# EasyEDA Pro project TPS5430开关电源设计.eprj

# Schematic Schematic1
Create Date: 2023-10-11; Page Name: P1; Project Name: EDA1; Schematic Name: Schematic1; Update Date: 2023-10-13; Company: 嘉立创EDA; Page Size: A4; Version: V1.0
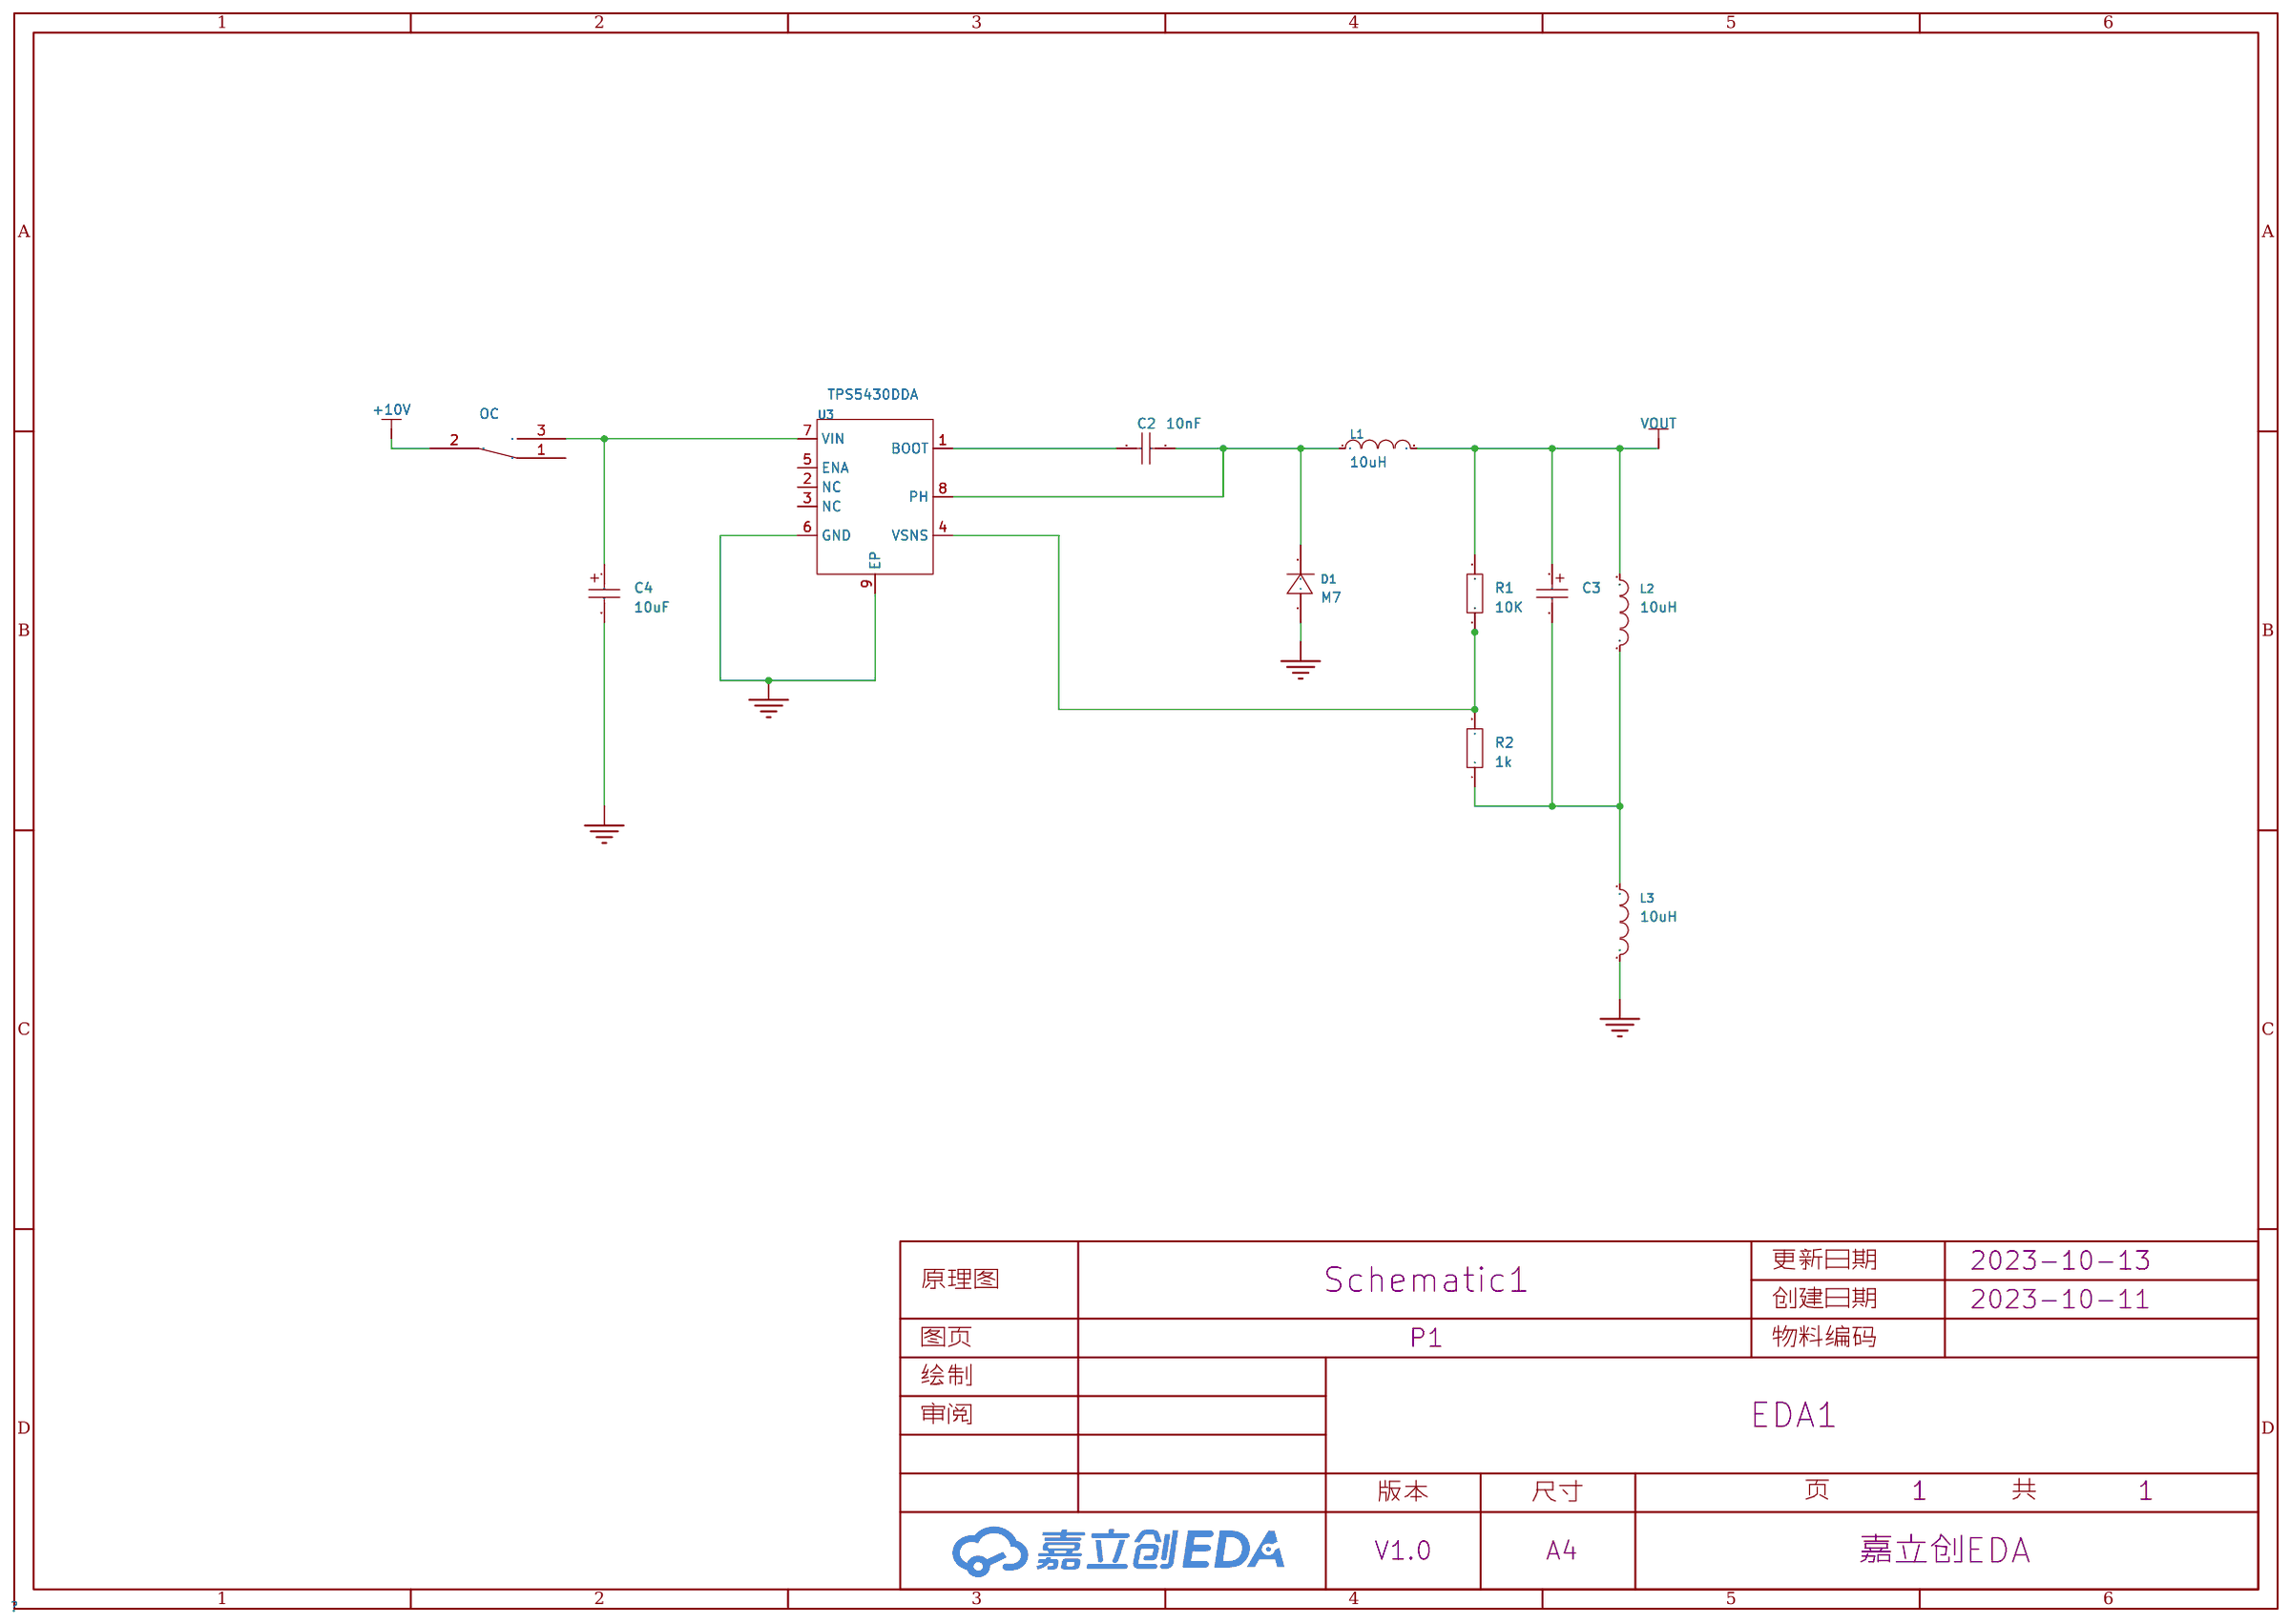
[diagram p0: schematic sheet]

## Parts
C2  10nF  [C0402]
C3  10uF  [CAP-SMD_L3.2-W1.6-RD]
C4  10uF  [CAP-SMD_L3.2-W1.6-RD-C7171]
D1  M7  [SMA_L4.3-W2.6-LS5.2-RD]
L1  10uH  [L0603]
L2  10uH  [L0603]
L3  10uH  [L0603]
OC  MT-0-102-A101-M200-RS  [SW-TH_MT-0-103-A101-M200-RS]
R1  10K  [R0603]
R2  1k  [R0603]
U3  TPS5430DDA  [ESOP-8_L4.9-W3.9-P1.27-LS6.0-BL-EP-2]

## Library data of the parts
C2 = CC0402KRX7R9BB103: 容值:10nF;精度:±10%;额定电压:50V;材质(温度系数):X7R;; LCSC Part Name: 10nF ±10% 50V; Supplier Part: C60133; Manufacturer: YAGEO(国巨); Supplier Footprint: 0402; JLCPCB Part Class: 扩展库; Datasheet: https://atta.szlcsc.com/upload/public/pdf/source/20151201/1457707601869.pdf; Supplier: LCSC; Tolerance: ±10%; Voltage Rated: 50V; Temperature Coefficient: X7R
C3 = CA45-A-16V-10uF-K: 容值:10uF;精度:±10%;额定电压:16V;等效串联电阻:10Ω@100kHz;; LCSC Part Name: 10uF ±10% 16V; Supplier Part: C128254; Manufacturer: CEC(振华新云); Supplier Footprint: CASE-A-3216; JLCPCB Part Class: 扩展库; Datasheet: https://atta.szlcsc.com/upload/public/pdf/source/20170914/C128254_1505359752472967905.pdf; Supplier: LCSC; Tolerance: ±10%; Rated Voltage: 16V; Equivalent Series Resistance(ESR): 10Ω@100kHz; Operating Temperature: -55℃~+125℃
C4 = TAJA106K016RNJ: 容值:10uF;精度:±10%;额定电压:16V;等效串联电阻:3Ω@100kHz;; LCSC Part Name: 10uF ±10% 16V; Supplier Part: C7171; Manufacturer: Kyocera AVX; Supplier Footprint: CASE-A-3216; JLCPCB Part Class: 基础库; Datasheet: https://atta.szlcsc.com/upload/public/pdf/source/20160107/1457707748093.pdf; Supplier: LCSC; Tolerance: ±10%; Rated Voltage: 16V; Equivalent Series Resistance(ESR): 3Ω@100kHz; Operating Temperature: -55℃~+125℃
D1 = M7_C95872: 二极管配置:-;直流反向耐压(Vr):1kV;平均整流电流(Io):1A;正向压降(Vf):1.1V@1A;; LCSC Part Name: 电压:1kV 电流:1A GPP; Supplier Part: C95872; Manufacturer: MDD; Supplier Footprint: SMA(DO-214AC); JLCPCB Part Class: 基础库; Datasheet: https://atta.szlcsc.com/upload/public/pdf/source/20230314/2A19294A7E86AE073FE0E8B47BC771B8.pdf; Supplier: LCSC; Reverse Voltage (Vr): 1kV; Average Rectified Current (Io): 1A; Forward Voltage (Vf@If): 1.1V@1A; Reverse Leakage Current: 5uA@1kV
L1-L3 = SDFL1608S100KTF: 电感值:10uH;精度:±10%;额定电流:3mA;饱和电流(Isat):-;直流电阻(DCR):1.85Ω;; LCSC Part Name: 10uH ±10% 3mA 1.85Ω; Supplier Part: C1035; Manufacturer: Sunlord(顺络); Supplier Footprint: 0603; JLCPCB Part Class: 基础库; Supplier: LCSC; Tolerance: ±10%; Rated Current: 3mA; DC Resistance (DCR): 1.85Ω; Q @ Freq: 30@2MHz; Frequency - Self Resonant: 2MHz
OC = MT-0-102-A101-M200-RS: 额定电流:5A;额定电压(AC):125V;电路结构:单刀双掷;机械寿命:-;安装方式:直插;; LCSC Part Name: 小型钮子三脚二档 五件套; Supplier Part: C1788492; Manufacturer: YUEN FUNG(源丰); Supplier Footprint: 插件; JLCPCB Part Class: Extended Part; Datasheet: https://atta.szlcsc.com/upload/public/pdf/source/20230720/8E5C36EFDF374AE4FF4AC09DB233CE0E.pdf; Supplier: LCSC; Contact Current: 5A; Voltage Rating (AC): 125V; Circuit: 单刀双掷; Actuator Type: 圆柱钮柄; Pin Style: 焊片; Mounting Style: 直插; Operating Temperature: -25℃~+85℃; Switch Length: 13mm; Switch Width: 8mm; Switch Height: 28.6mm
R1 R2 = Res_0603: Supplier Footprint: 0603
U3 = TPS5430DDA: 功能类型:降压型;输出类型:可调;输入电压:5.5V~36V;输出电压:1.221V~32.04V;输出电流(最大值):3A;; Supplier Part: C502477; Manufacturer: TI(德州仪器); Supplier Footprint: SOP-8-EP; JLCPCB Part Class: 扩展库; Datasheet: https://www.ti.com/cn/lit/gpn/tps5430; Supplier: LCSC; Function: 降压型; Synchronous Rectification: 否; Output Type: 可调; Number of Outputs: 1; Topology: 降压式; Input Voltage: 5.5V~36V; Output Voltage: 1.221V~32.04V; Output Current (Max): 3A; Switching Frequency: 500kHz; Operating Temperature: -40℃~+125℃@(TJ)

## Nets
+10V: OC.2
GND: C4.2 D1.2(A) L3.2 U3.6(GND) U3.9(EP)
VOUT: C3.1 L1.2 L2.1 R1.2
Net-(C2-1): C2.1 U3.1(BOOT)
Net-(C2-2): C2.2 D1.1(K) L1.1 U3.8(PH)
Net-(C3-2): C3.2 L2.2 L3.1 R2.1
Net-(C4-1): C4.1 OC.3 U3.7(VIN)
Net-(R1-1): R1.1 R2.2 U3.4(VSNS)

Not connected (* = marked no-connect by the designer): OC 1; U3 2(NC) 3(NC) 5(ENA)
